# Altium project Astropix_Carrier.PrjPcb
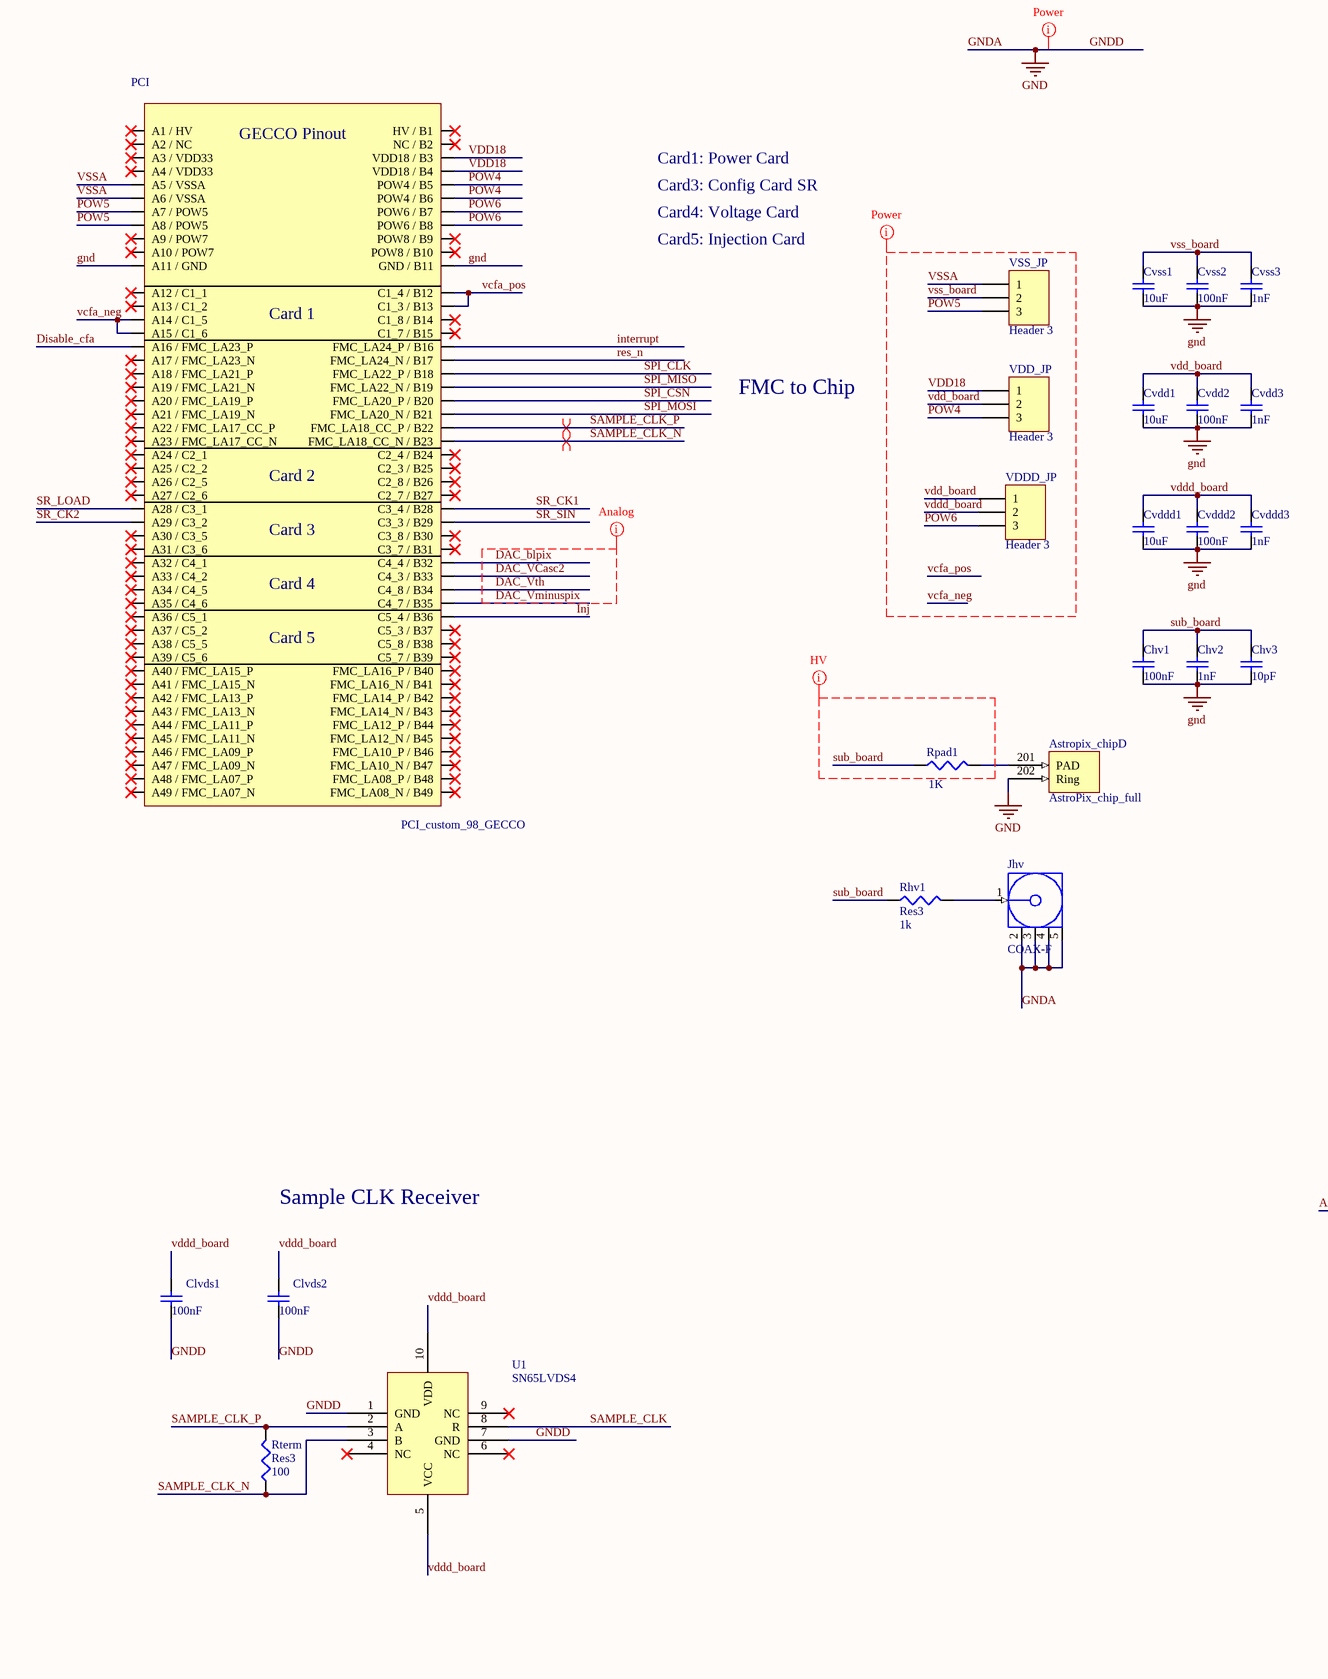
[diagram p0: PCI_ASTROPIX_carrier.SchDoc, left]
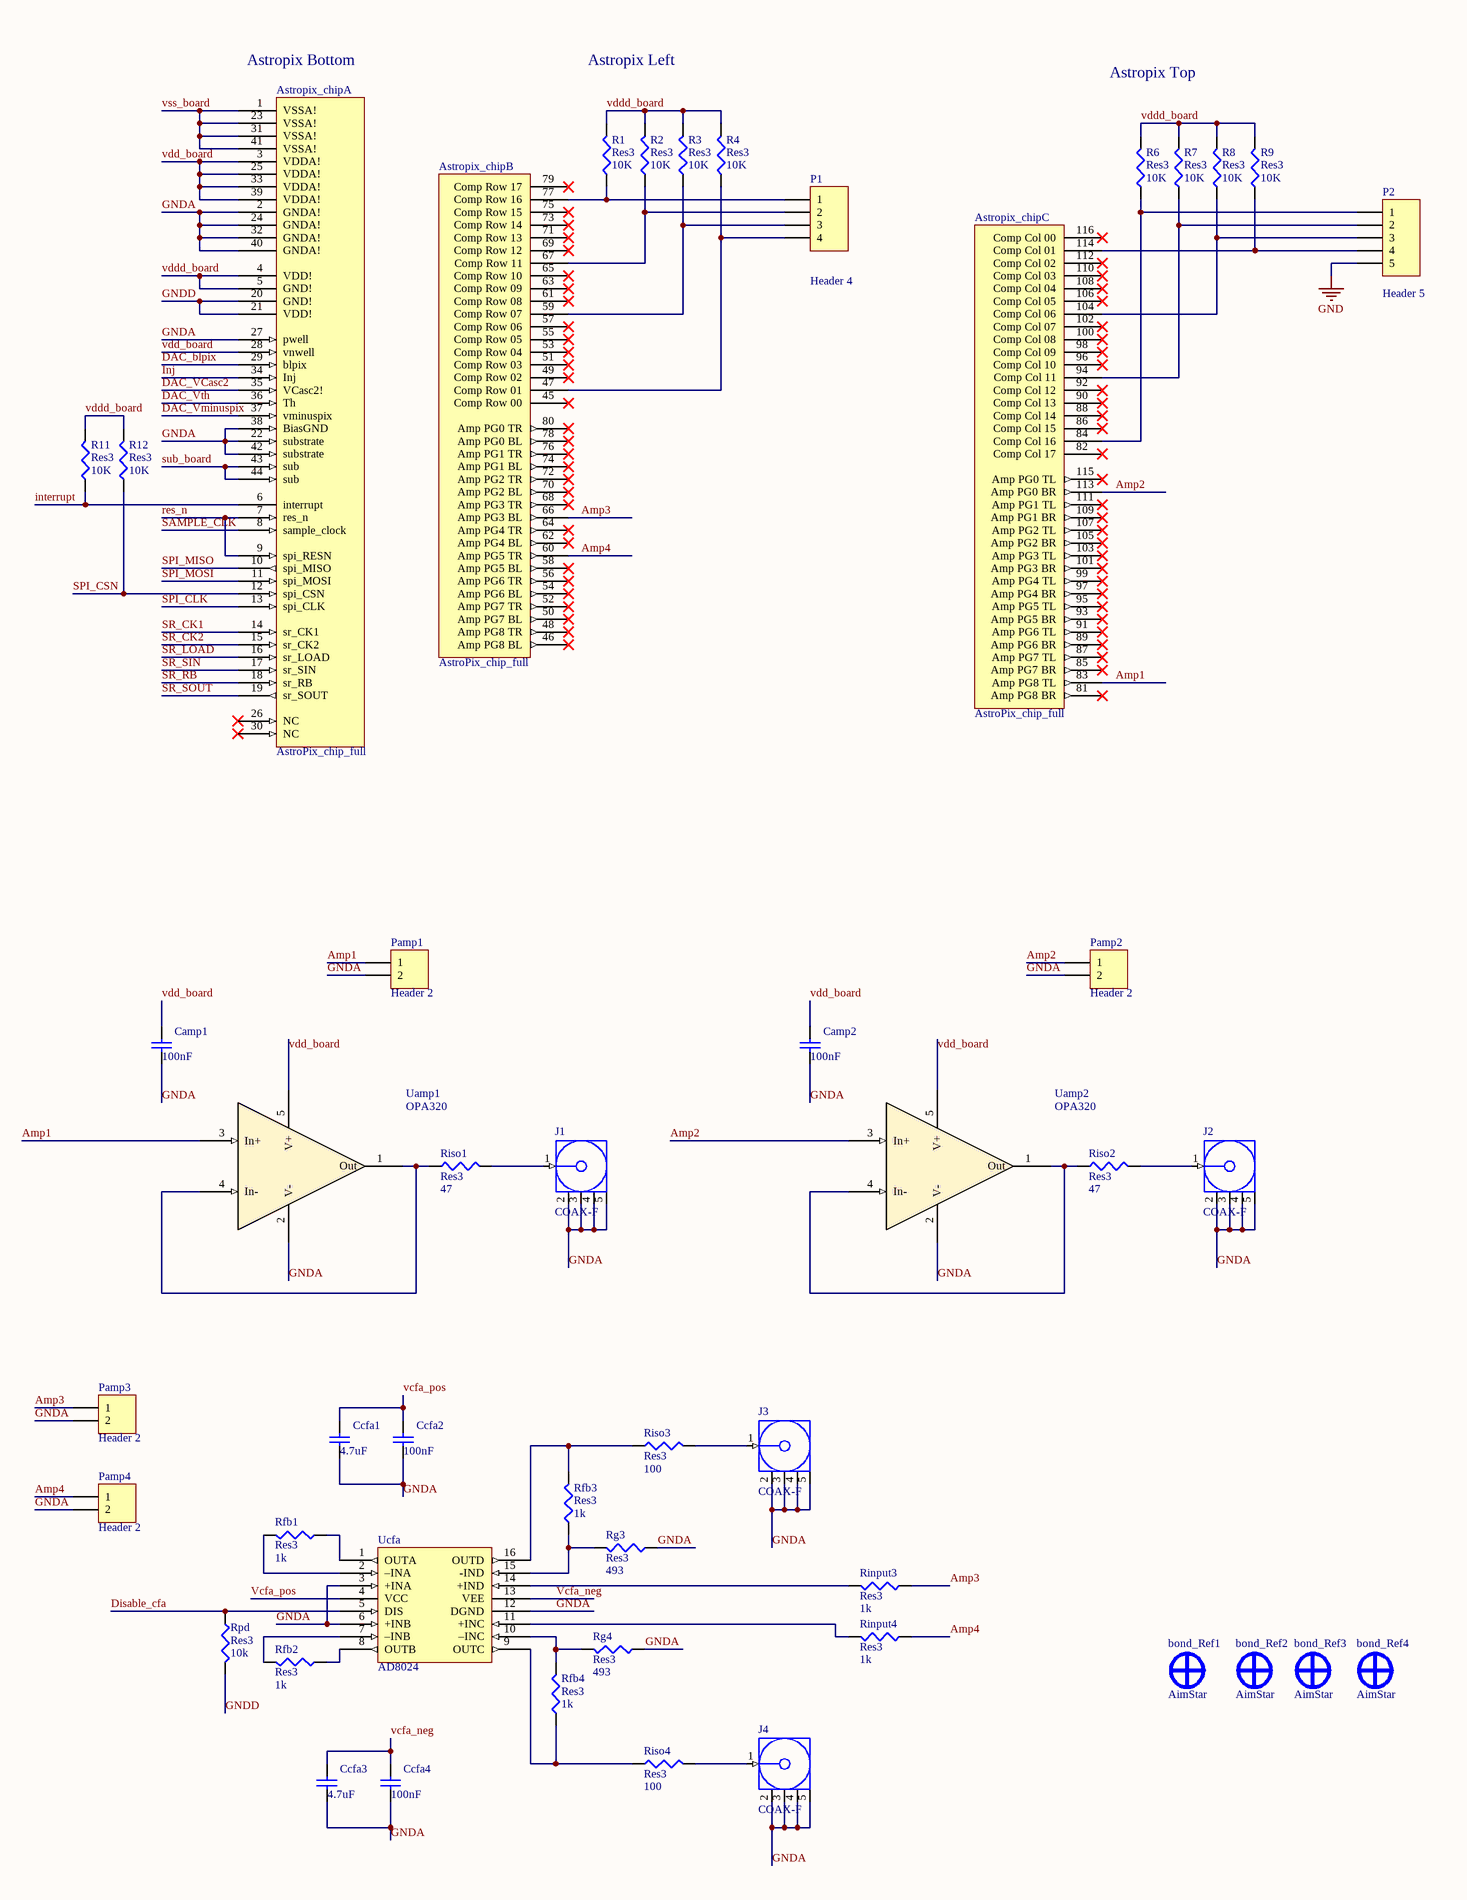
[diagram p1: PCI_ASTROPIX_carrier.SchDoc, right]
1 sheet, 70 parts. Net scope: global (net labels, ports and power ports of the same name join across sheets).
Board file: PCI_ASTROPIX_carrier.PcbDoc

## Sheet PCI_ASTROPIX_carrier.SchDoc: ASTROPIX Carrier
size A2; DrawnBy: Nicolas Striebig; SheetNumber: 1; SheetTotal: 1

### Parts
Astropix_chip  AstroPix_chip_full  [Astropix_Chip_w_bondpads_1mm_distance_125u _final]  (parts A,B,C,D of 4)
bond_Ref1  AimStar  [AimStar]
bond_Ref2  AimStar  [AimStar]
bond_Ref3  AimStar  [AimStar]
bond_Ref4  AimStar  [AimStar]
Camp1  value 100nF  [1608[0603]]  (hidden comment: Cap Semi)
Camp2  value 100nF  [1608[0603]]  (hidden comment: Cap Semi)
Ccfa1  value 4.7uF  [1608[0603]]  (hidden comment: Cap Semi)
Ccfa2  value 100nF  [1608[0603]]  (hidden comment: Cap Semi)
Ccfa3  value 4.7uF  [1608[0603]]  (hidden comment: Cap Semi)
Ccfa4  value 100nF  [1608[0603]]  (hidden comment: Cap Semi)
Chv1  value 100nF  [C1210]  (hidden comment: Cap Semi)
Chv2  value 1nF  [C1210]  (hidden comment: Cap Semi)
Chv3  value 10pF  [C1210]  (hidden comment: Cap Semi)
Clvds1  value 100nF  [1608[0603]]  (hidden comment: Cap Semi)
Clvds2  value 100nF  [1608[0603]]  (hidden comment: Cap Semi)
Cvdd1  value 10uF  [1608[0603]]  (hidden comment: Cap Semi)
Cvdd2  value 100nF  [1608[0603]]  (hidden comment: Cap Semi)
Cvdd3  value 1nF  [1608[0603]]  (hidden comment: Cap Semi)
Cvddd1  value 10uF  [1608[0603]]  (hidden comment: Cap Semi)
Cvddd2  value 100nF  [1608[0603]]  (hidden comment: Cap Semi)
Cvddd3  value 1nF  [1608[0603]]  (hidden comment: Cap Semi)
Cvss1  value 10uF  [1608[0603]]  (hidden comment: Cap Semi)
Cvss2  value 100nF  [1608[0603]]  (hidden comment: Cap Semi)
Cvss3  value 1nF  [1608[0603]]  (hidden comment: Cap Semi)
J1  COAX-F  [MCX5.08-H5]
J2  COAX-F  [MCX5.08-H5]
J3  COAX-F  [MCX5.08-H5]
J4  COAX-F  [MCX5.08-H5]
Jhv  COAX-F  [MCX5.08-H5]
P1  Header 4  [HDR1X4]
P2  Header 5  [HDR1X5]
Pamp1  Header 2  [HDR1X2]
Pamp2  Header 2  [HDR1X2]
Pamp3  Header 2  [HDR1X2]
Pamp4  Header 2  [HDR1X2]
PCI  PCI_custom_98_GECCO  [PCI_for_PCB_98]
R1  Res3  value 10K  [J1-0603]
R2  Res3  value 10K  [J1-0603]
R3  Res3  value 10K  [J1-0603]
R4  Res3  value 10K  [J1-0603]
R6  Res3  value 10K  [J1-0603]
R7  Res3  value 10K  [J1-0603]
R8  Res3  value 10K  [J1-0603]
R9  Res3  value 10K  [J1-0603]
R11  Res3  value 10K  [J1-0603]
R12  Res3  value 10K  [J1-0603]
Rfb1  Res3  value 1k  [J1-0603]
Rfb2  Res3  value 1k  [J1-0603]
Rfb3  Res3  value 1k  [J1-0603]
Rfb4  Res3  value 1k  [J1-0603]
Rg3  Res3  value 493  [J1-0603]
Rg4  Res3  value 493  [J1-0603]
Rhv1  Res3  value 1k  [14-1210]
Rinput3  Res3  value 1k  [J1-0603]
Rinput4  Res3  value 1k  [J1-0603]
Riso1  Res3  value 47  [J1-0603]
Riso2  Res3  value 47  [J1-0603]
Riso3  Res3  value 100  [J1-0603]
Riso4  Res3  value 100  [J1-0603]
Rpad1  value 1K  [J1-0603]  (hidden comment: Res3)
Rpd  Res3  value 10k  [J1-0603]
Rterm  Res3  value 100  [J1-0603]
U1  SN65LVDS4  [SN65LVDS4RSER]
Uamp1  OPA320  [SOT95P245X110-5N]
Uamp2  OPA320  [SOT95P245X110-5N]
Ucfa  AD8024  [SOIC127P600X265-16N]
VDD_JP  Header 3  [HDR1X3]
VDDD_JP  Header 3  [HDR1X3]
VSS_JP  Header 3  [HDR1X3]

### Nets
gnd: Astropix_chip.2(GNDA!) Astropix_chip.20(GND!) Astropix_chip.21(VDD!) Astropix_chip.22(substrate) Astropix_chip.24(GNDA!) Astropix_chip.27(pwell) Astropix_chip.32(GNDA!) Astropix_chip.38(BiasGND) Astropix_chip.40(GNDA!) Astropix_chip.42(substrate) Astropix_chip.202(Ring) Camp1.1 Camp2.1 Ccfa1.1 Ccfa2.1 Ccfa3.1 Ccfa4.1 Chv1.1 Chv2.1 Chv3.1 Clvds1.1 Clvds2.1 Cvdd1.1 Cvdd2.1 Cvdd3.1 Cvddd1.1 Cvddd2.1 Cvddd3.1 Cvss1.1 Cvss2.1 Cvss3.1 J1.2(GND) J1.3(GND) J1.4(GND) J1.5(GND) J2.2(GND) J2.3(GND) J2.4(GND) J2.5(GND) J3.2(GND) J3.3(GND) J3.4(GND) J3.5(GND) J4.2(GND) J4.3(GND) J4.4(GND) J4.5(GND) Jhv.2(GND) Jhv.3(GND) Jhv.4(GND) Jhv.5(GND) P2.5 Pamp1.2 Pamp2.2 Pamp3.2 Pamp4.2 PCI.A11(A11_/_GND) PCI.B11(GND_/_B11) Rg3.1 Rg4.1 Rpd.2 U1.1(GND) U1.7(GND) Uamp1.2(V-) Uamp2.2(V-) Ucfa.3(+INA) Ucfa.6(+INB) Ucfa.12(DGND)  [also labelled GNDA, GNDD]
Amp1: Astropix_chip.83(Amp_PG8_TL) Pamp1.1 Uamp1.3(In+)
Amp2: Astropix_chip.113(Amp_PG0_BR) Pamp2.1 Uamp2.3(In+)
Amp3: Astropix_chip.66(Amp_PG3_BL) Pamp3.1 Rinput3.1
Amp4: Astropix_chip.60(Amp_PG5_TR) Pamp4.1 Rinput4.1
DAC_blpix: Astropix_chip.29(blpix) PCI.B32(C4_4_/_B32)
DAC_VCasc2: Astropix_chip.35(VCasc2!) PCI.B33(C4_3_/_B33)
DAC_Vminuspix: Astropix_chip.37(vminuspix) PCI.B35(C4_7_/_B35)
DAC_Vth: Astropix_chip.36(Th) PCI.B34(C4_8_/_B34)
Disable_cfa: PCI.A16(A16_/_FMC_LA23_P) Rpd.1 Ucfa.5(DIS)
Inj: Astropix_chip.34(Inj) PCI.B36(C5_4_/_B36)
interrupt: Astropix_chip.6(interrupt) PCI.B16(FMC_LA24_P_/_B16) R11.1
POW4: PCI.B5(POW4_/_B5) PCI.B6(POW4_/_B6) VDD_JP.3
POW5: PCI.A7(A7_/_POW5) PCI.A8(A8_/_POW5) VSS_JP.3
POW6: PCI.B7(POW6_/_B7) PCI.B8(POW6_/_B8) VDDD_JP.3
res_n: Astropix_chip.7(res_n) Astropix_chip.9(spi_RESN) PCI.B17(FMC_LA24_N_/_B17)
SAMPLE_CLK: Astropix_chip.8(sample_clock) U1.8(R)
SAMPLE_CLK_N: PCI.B23(FMC_LA18_CC_N_/_B23) Rterm.1 U1.3(B)
SAMPLE_CLK_P: PCI.B22(FMC_LA18_CC_P_/_B22) Rterm.2 U1.2(A)
SPI_CLK: Astropix_chip.13(spi_CLK) PCI.B18(FMC_LA22_P_/_B18)
SPI_CSN: Astropix_chip.12(spi_CSN) PCI.B20(FMC_LA20_P_/_B20) R12.1
SPI_MISO: Astropix_chip.10(spi_MISO) PCI.B19(FMC_LA22_N_/_B19)
SPI_MOSI: Astropix_chip.11(spi_MOSI) PCI.B21(FMC_LA20_N_/_B21)
SR_CK1: Astropix_chip.14(sr_CK1) PCI.B28(C3_4_/_B28)
SR_CK2: Astropix_chip.15(sr_CK2) PCI.A29(A29_/_C3_2)
SR_LOAD: Astropix_chip.16(sr_LOAD) PCI.A28(A28_/_C3_1)
SR_RB: Astropix_chip.18(sr_RB)
SR_SIN: Astropix_chip.17(sr_SIN) PCI.B29(C3_3_/_B29)
SR_SOUT: Astropix_chip.19(sr_SOUT)
sub_board: Astropix_chip.43(sub) Astropix_chip.44(sub) Chv1.2 Chv2.2 Chv3.2 Rhv1.1 Rpad1.1
Vcfa_neg: Ccfa3.2 Ccfa4.2 PCI.A14(A14_/_C1_5) PCI.A15(A15_/_C1_6) Ucfa.13(VEE)
vcfa_pos: Ccfa1.2 Ccfa2.2 PCI.B12(C1_4_/_B12) PCI.B13(C1_3_/_B13) Ucfa.4(VCC)
VDD18: PCI.B3(VDD18_/_B3) PCI.B4(VDD18_/_B4) VDD_JP.1
vdd_board: Astropix_chip.3(VDDA!) Astropix_chip.25(VDDA!) Astropix_chip.28(vnwell) Astropix_chip.33(VDDA!) Astropix_chip.39(VDDA!) Camp1.2 Camp2.2 Cvdd1.2 Cvdd2.2 Cvdd3.2 Uamp1.5(V+) Uamp2.5(V+) VDD_JP.2 VDDD_JP.1
vddd_board: Astropix_chip.4(VDD!) Astropix_chip.5(GND!) Clvds1.2 Clvds2.2 Cvddd1.2 Cvddd2.2 Cvddd3.2 R1.2 R2.2 R3.2 R4.2 R6.2 R7.2 R8.2 R9.2 R11.2 R12.2 U1.5(VCC) U1.10(VDD) VDDD_JP.2
vss_board: Astropix_chip.1(VSSA!) Astropix_chip.23(VSSA!) Astropix_chip.31(VSSA!) Astropix_chip.41(VSSA!) Cvss1.2 Cvss2.2 Cvss3.2 VSS_JP.2
VSSA: PCI.A5(A5_/_VSSA) PCI.A6(A6_/_VSSA) VSS_JP.1
NetAstropix_chip_47: Astropix_chip.47(Comp_Row_01) P1.4 R4.1
NetAstropix_chip_59: Astropix_chip.59(Comp_Row_07) P1.3 R3.1
NetAstropix_chip_67: Astropix_chip.67(Comp_Row_11) P1.2 R2.1
NetAstropix_chip_77: Astropix_chip.77(Comp_Row_16) P1.1 R1.1
NetAstropix_chip_84: Astropix_chip.84(Comp_Col_16) P2.1 R6.1
NetAstropix_chip_94: Astropix_chip.94(Comp_Col_11) P2.2 R7.1
NetAstropix_chip_104: Astropix_chip.104(Comp_Col_06) P2.3 R8.1
NetAstropix_chip_114: Astropix_chip.114(Comp_Col_01) P2.4 R9.1
NetAstropix_chip_201: Astropix_chip.201(PAD) Rpad1.2
NetJ1_1: J1.1(Signal) Riso1.2
NetJ2_1: J2.1(Signal) Riso2.2
NetJ3_1: J3.1(Signal) Riso3.2
NetJ4_1: J4.1(Signal) Riso4.2
NetJhv_1: Jhv.1(Signal) Rhv1.2
NetRfb1_1: Rfb1.1 Ucfa.1(OUTA)
NetRfb1_2: Rfb1.2 Ucfa.2(–INA)
NetRfb2_1: Rfb2.1 Ucfa.8(OUTB)
NetRfb2_2: Rfb2.2 Ucfa.7(–INB)
NetRfb3_1: Rfb3.1 Rg3.2 Ucfa.15(-IND)
NetRfb3_2: Rfb3.2 Riso3.1 Ucfa.16(OUTD)
NetRfb4_1: Rfb4.1 Riso4.1 Ucfa.9(OUTC)
NetRfb4_2: Rfb4.2 Rg4.2 Ucfa.10(–INC)
NetRinput3_2: Rinput3.2 Ucfa.14(+IND)
NetRinput4_2: Rinput4.2 Ucfa.11(+INC)
NetRiso1_1: Riso1.1 Uamp1.1(Out) Uamp1.4(In-)
NetRiso2_1: Riso2.1 Uamp2.1(Out) Uamp2.4(In-)

Not connected (* = marked no-connect by the designer): Astropix_chip 26(NC)* 30(NC)* 45(Comp_Row_00)* 46(Amp_PG8_BL)* 48(Amp_PG8_TR)* 49(Comp_Row_02)* 50(Amp_PG7_BL)* 51(Comp_Row_03)* 52(Amp_PG7_TR)* 53(Comp_Row_04)* 54(Amp_PG6_BL)* 55(Comp_Row_05)* 56(Amp_PG6_TR)* 57(Comp_Row_06)* 58(Amp_PG5_BL)* 61(Comp_Row_08)* 62(Amp_PG4_BL)* 63(Comp_Row_09)* 64(Amp_PG4_TR)* 65(Comp_Row_10)* 68(Amp_PG3_TR)* 69(Comp_Row_12)* 70(Amp_PG2_BL)* 71(Comp_Row_13)* 72(Amp_PG2_TR)* 73(Comp_Row_14)* 74(Amp_PG1_BL)* 75(Comp_Row_15)* 76(Amp_PG1_TR)* 78(Amp_PG0_BL)* 79(Comp_Row_17)* 80(Amp_PG0_TR)* 81(Amp_PG8_BR)* 82(Comp_Col_17)* 85(Amp_PG7_BR)* 86(Comp_Col_15)* 87(Amp_PG7_TL)* 88(Comp_Col_14)* 89(Amp_PG6_BR)* 90(Comp_Col_13)* 91(Amp_PG6_TL)* 92(Comp_Col_12)* 93(Amp_PG5_BR)* 95(Amp_PG5_TL)* 96(Comp_Col_10)* 97(Amp_PG4_BR)* 98(Comp_Col_09)* 99(Amp_PG4_TL)* 100(Comp_Col_08)* 101(Amp_PG3_BR)* 102(Comp_Col_07)* 103(Amp_PG3_TL)* 105(Amp_PG2_BR)* 106(Comp_Col_05)* 107(Amp_PG2_TL)* 108(Comp_Col_04)* 109(Amp_PG1_BR)* 110(Comp_Col_03)* 111(Amp_PG1_TL)* 112(Comp_Col_02)* 115(Amp_PG0_TL)* 116(Comp_Col_00)*; PCI A1(A1_/_HV)* A2(A2_/_NC)* A3(A3_/_VDD33)* A4(A4_/_VDD33)* A9(A9_/_POW7)* A10(A10_/_POW7)* A12(A12_/_C1_1)* A13(A13_/_C1_2)* A17(A17_/_FMC_LA23_N)* A18(A18_/_FMC_LA21_P)* A19(A19_/_FMC_LA21_N)* A20(A20_/_FMC_LA19_P)* A21(A21_/_FMC_LA19_N)* A22(A22_/_FMC_LA17_CC_P)* A23(A23_/_FMC_LA17_CC_N)* A24(A24_/_C2_1)* A25(A25_/_C2_2)* A26(A26_/_C2_5)* A27(A27_/_C2_6)* A30(A30_/_C3_5)* A31(A31_/_C3_6)* A32(A32_/_C4_1)* A33(A33_/_C4_2)* A34(A34_/_C4_5)* A35(A35_/_C4_6)* A36(A36_/_C5_1)* A37(A37_/_C5_2)* A38(A38_/_C5_5)* A39(A39_/_C5_6)* A40(A40_/_FMC_LA15_P)* A41(A41_/_FMC_LA15_N)* A42(A42_/_FMC_LA13_P)* A43(A43_/_FMC_LA13_N)* A44(A44_/_FMC_LA11_P)* A45(A45_/_FMC_LA11_N)* A46(A46_/_FMC_LA09_P)* A47(A47_/_FMC_LA09_N)* A48(A48_/_FMC_LA07_P)* A49(A49_/_FMC_LA07_N)* B1(HV_/_B1)* B2(NC_/_B2)* B9(POW8_/_B9)* B10(POW8_/_B10)* B14(C1_8_/_B14)* B15(C1_7_/_B15)* B24(C2_4_/_B24)* B25(C2_3_/_B25)* B26(C2_8_/_B26)* B27(C2_7_/_B27)* B30(C3_8_/_B30)* B31(C3_7_/_B31)* B37(C5_3_/_B37)* B38(C5_8_/_B38)* B39(C5_7_/_B39)* B40(FMC_LA16_P_/_B40)* B41(FMC_LA16_N_/_B41)* B42(FMC_LA14_P_/_B42)* B43(FMC_LA14_N_/_B43)* B44(FMC_LA12_P_/_B44)* B45(FMC_LA12_N_/_B45)* B46(FMC_LA10_P_/_B46)* B47(FMC_LA10_N_/_B47)* B48(FMC_LA08_P_/_B48)* B49(FMC_LA08_N_/_B49)*; U1 4(NC)* 6(NC)* 9(NC)*

### Layout directives
differential pair; differential pair class Diffpair: SAMPLE_CLK_P
differential pair: SAMPLE_CLK_N
net class Power: gnd, POW4, POW5, POW6, vcfa_neg, vcfa_pos, VDD18, vdd_board, vddd_board, vss_board, VSSA
net class HV: sub_board
net class Analog: DAC_blpix, DAC_VCasc2, DAC_Vminuspix, DAC_Vth

### Notes on the sheet
- (near Astropix_chip) Astropix Bottom
- Astropix Left
- Astropix Top
- Card4: Voltage Card
- Card3: Config Card SR
- Card1: Power Card
- Card5: Injection Card
- FMC to Chip
- Sample CLK Receiver
- Title
- Size:
- Date:
- File:
- A2
- Number:
- Time:
- Revision:
- Sheet
- of
- (in symbol PCI_custom_98_GECCO) GECCO Pinout; Card 1; Card 2; Card 3; Card 4; Card 5

### Library data of the parts
Camp1 Camp2 Ccfa1-Ccfa4 Chv1-Chv3 Clvds1 Clvds2 Cvdd1-Cvdd3 Cvddd1-Cvddd3 Cvss1-Cvss3 = Cap Semi: Capacitor (Semiconductor SIM Model); Published: 8-Jun-2000; LatestRevisionDate: 29-May-2009; LatestRevisionNote: IPC-7351 Footprint Added.; PackageReference: C1206; Publisher: Altium Limited; PackageDescription: Chip Capacitor
J1-J4 Jhv = COAX-F: RF Coaxial PCB Connector, MCX; Thru-Hole, Right-Angle Mount Socket, Blunt Post Terminal, 50 Ohm Impedance; PCB_Layout: Complies with manufacturer's recommendation.; DrillSize: Corresponds to nominal value.; Published: 15-Jul-2004; LatestRevisionDate: 15-Jul-2004; LatestRevisionNote: Component Replaced.; DatasheetDocument: 30-May-2003; PackageDocument: 04-Jul-1999; PackageReference: 919-119J-51AX; Publisher: Altium Limited; ComponentLink1Description: Manufacturer Link; ComponentLink1URL: http://www.amphenolrf.com/
P1 = Header 4: Header, 4-Pin; LatestRevisionDate: 17-Jul-2002; LatestRevisionNote: Re-released for DXP Platform.; Publisher: Altium Limited
P2 = Header 5: Header, 5-Pin; LatestRevisionDate: 17-Jul-2002; LatestRevisionNote: Re-released for DXP Platform.; Publisher: Altium Limited
Pamp1-Pamp4 = Header 2: Header, 2-Pin; LatestRevisionDate: 17-Jul-2002; LatestRevisionNote: Re-released for DXP Platform.; Publisher: Altium Limited
R1-R4 R6-R9 R11 R12 Rfb1-Rfb4 Rg3 Rg4 Rhv1 Rinput3 Rinput4 Riso1-Riso4 Rpad1 Rpd Rterm = Res3: Resistor; Published: 8-Jun-2000; LatestRevisionDate: 29-May-2009; LatestRevisionNote: IPC-7351 Footprint Added.; PackageReference: J1-0603; Publisher: Altium Limited; PackageDescription: Chip Resistor
U1 = SN65LVDS4: 1.8-V High-Speed  Differential  Line Receiver
VDD_JP VDDD_JP VSS_JP = Header 3: Header, 3-Pin; LatestRevisionDate: 17-Jul-2002; LatestRevisionNote: Re-released for DXP Platform.; Publisher: Altium Limited